# EAGLE design SDCardPlayer8BitMono (EAGLE 7.2.0)
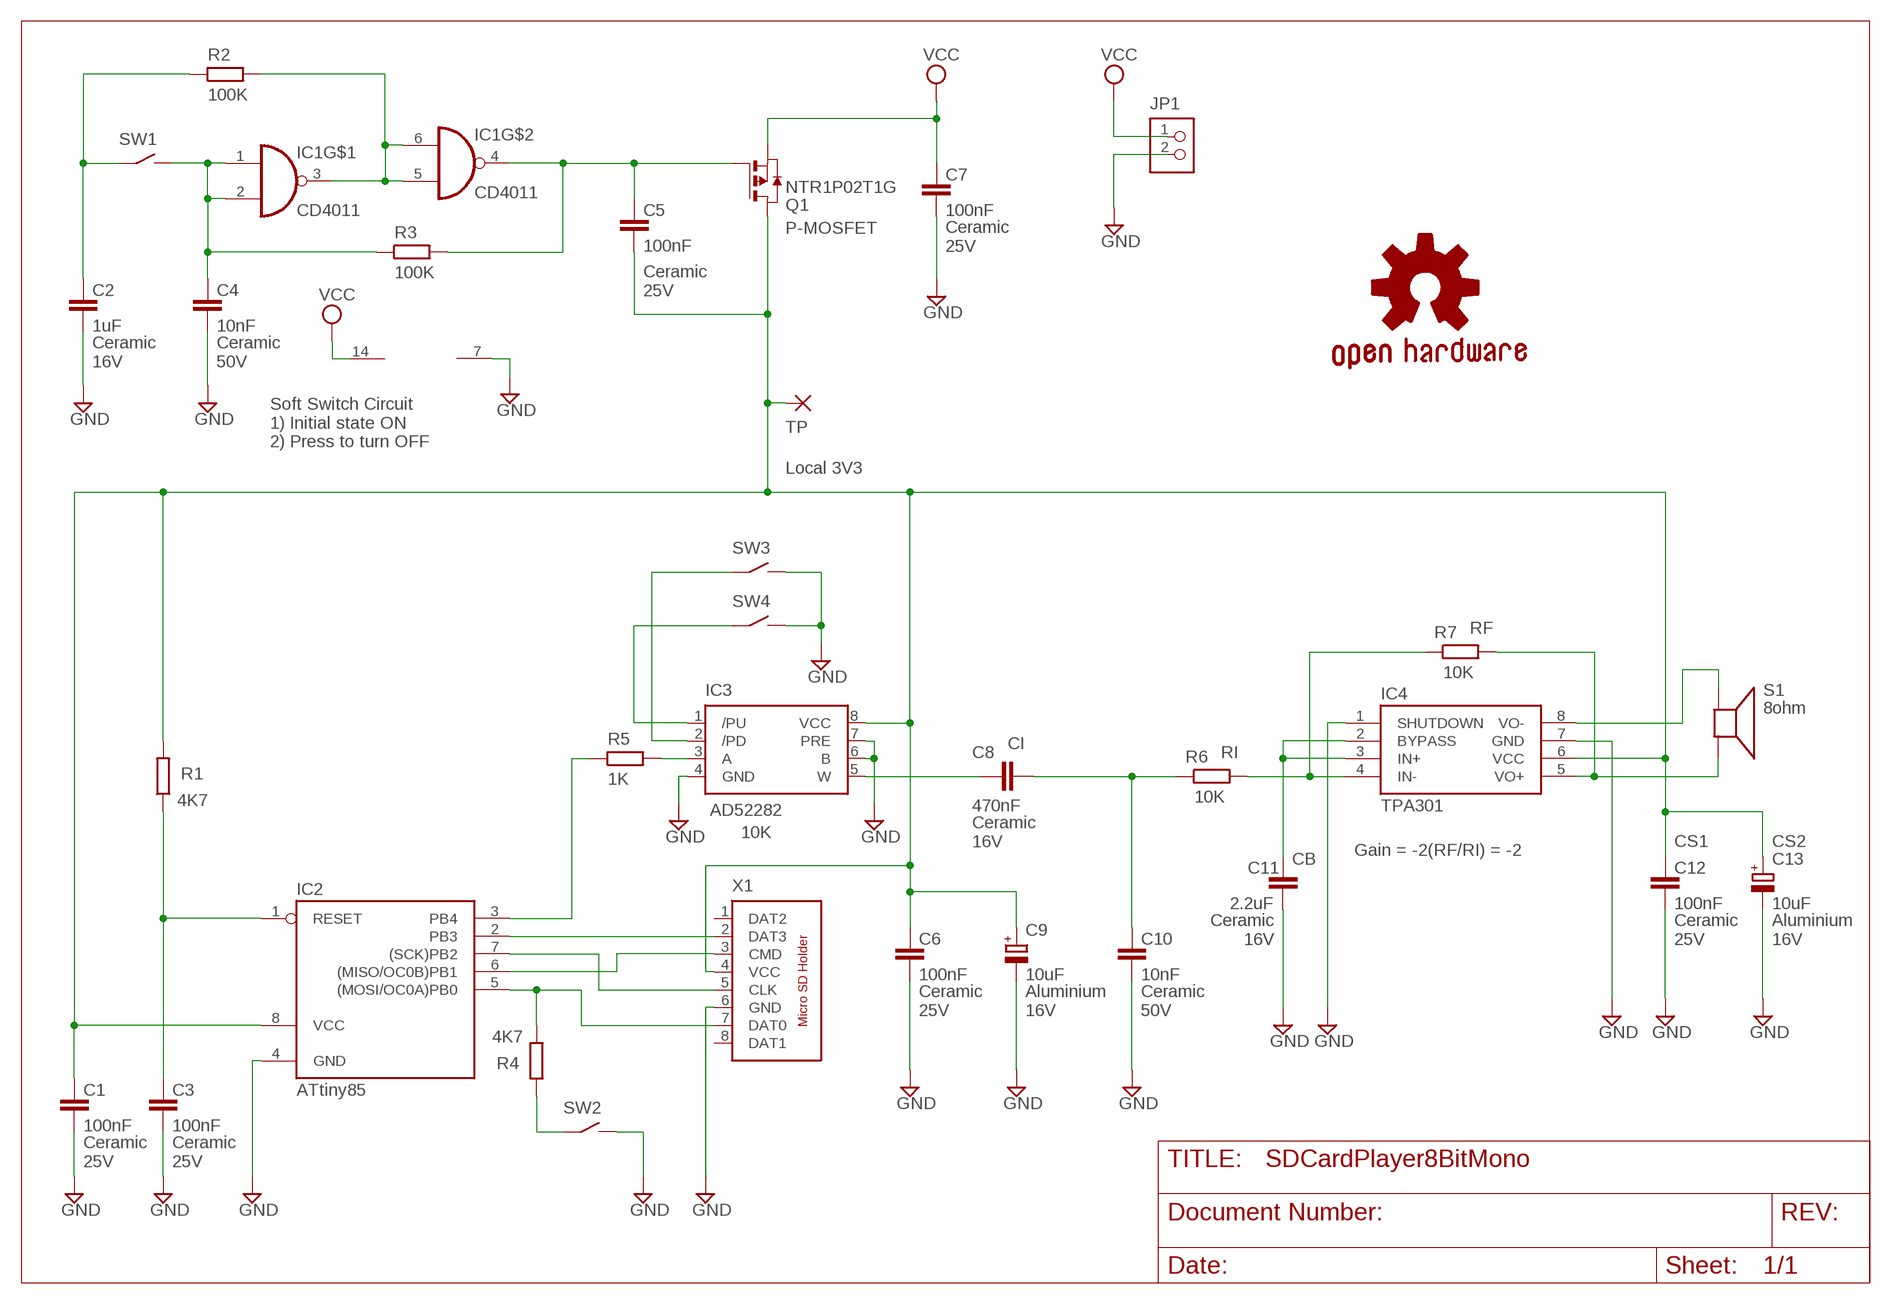
[diagram p0: schematic, sheet 1]

## Parts
C1  100nF  CAPACITOR  [P-0805]
C2  1uF  CAPACITOR  [P-0805]
C3  100nF  CAPACITOR  [P-0805]
C4  10nF  CAPACITOR  [P-0805]
C5  100nF  CAPACITOR  [P-0805]
C6  100nF  CAPACITOR  [P-0805]
C7  100nF  CAPACITOR  [P-0805]
C8  470nF  CAPACITOR  [P-0805]
C9  10uF  CAPACITOR-POL3  [P-CAPNICHICON-3MM]
C10  10nF  CAPACITOR  [P-0805]
C11  2.2uF  CAPACITOR  [P-0805]
C12  100nF  CAPACITOR  [P-0805]
C13  10uF  CAPACITOR-POL3  [P-CAPNICHICON-3MM]
GOLD_ORB_SM1  OSHWLOGO_GOLD_ORB_SM  [OSHW2]
IC1  CD4011  [P-SOIC14]
IC2  ATtiny85  ATTINY252  [P-DIL8]
IC3  AD52282  [P-SOT23-8E]
IC4  TPA301  [P-SO8]
JP1  JST-XH-1X021  [P-JST-XH-1X02]
Q1  NTR1P02T1G  P-MOSFET2  [P-SOT23-3E]
R1  4K7  RESISTOR""  [P-0805]
R2  100K  RESISTOR""  [P-0805]
R3  100K  RESISTOR""  [P-0805]
R4  4K7  RESISTOR""  [P-0805]
R5  1K  RESISTOR""  [P-0805]
R6  10K  RESISTOR""  [P-0805]
R7  10K  RESISTOR""  [P-0805]
S1  8ohm  SPEAKER2  [P-JST-XH-1X02]
SW1  SWITCH-2PIN4  [P-JST-XH-1X02]
SW2  SWITCH-2PIN4  [P-JST-XH-1X02]
SW3  SWITCH-2PIN4  [P-JST-XH-1X02]
SW4  SWITCH-2PIN4  [P-JST-XH-1X02]
TP  PAD  [P-PAD127X127]
X1  MICRO-SD-CARD-HOLDER  [P-MICRO-SD-CARD-HOLDER]

## Nets
GND: C1.2 C2.2 C3.2 C4.2 C6.2 C7.2 C9.2(-) C10.2 C11.2 C12.2 C13.2(-) IC1.7(GND) IC2.4(GND) IC3.4(GND) IC3.6(B) IC3.7(PRE) IC4.1(SHUTDOWN) IC4.7(GND) JP1.2 SW2.2 SW3.2 SW4.2 X1.6(GND)
N$1: C3.1 IC2.1(RESET) R1.1
N$2: R4.2 SW2.1
N$3: IC2.5((MOSI/OC0A)PB0) R4.1 X1.7(DAT0)
N$4: IC2.2(PB3) X1.2(DAT3)
N$5: IC2.3(PB4) R5.1
N$7: IC1.3(O) IC1.5(I1) IC1.6(I0) R2.2
N$8: C4.1 IC1.1(I0) IC1.2(I1) R3.1 SW1.2
N$9: C5.1 IC1.4(O) Q1.1(G) R3.2
N$10: C8.2 C10.1 R6.1
N$11: IC4.4(IN-) R6.2 R7.1
N$12: C2.1 R2.1 SW1.1
N$13: C11.1 IC4.2(BYPASS) IC4.3(IN+)
N$14: IC4.5(VO+) R7.2 S1.2
N$15: IC4.8(VO-) S1.1
N$16: C8.1 IC3.5(W)
N$17: IC3.2(/PD) SW3.1
N$18: IC3.1(/PU) SW4.1
N$19: IC3.3(A) R5.2
N$20: IC2.6((MISO/OC0B)PB1) X1.3(CMD)
N$21: C1.1 C5.2 C6.1 C9.1(+) C12.1 C13.1(+) IC2.8(VCC) IC3.8(VCC) IC4.6(VCC) Q1.3(D) R1.2 TP.P$1(P) X1.4(VCC)
N$23: IC2.7((SCK)PB2) X1.5(CLK)
VCC: C7.1 IC1.14(VCC) JP1.1 Q1.2(S)
Unconnected: IC1.8(I0) IC1.9(I1) IC1.10(O) IC1.11(O) IC1.12(I1) IC1.13(I0) X1.1(DAT2) X1.8(DAT1)

## Notes on the sheet
- P-MOSFET
- Ceramic
  25V
- Ceramic
  25V
- Ceramic
  16V
- Ceramic
  50V
- Soft Switch Circuit
  1) Initial state ON
  2) Press to turn OFF
- Local 3V3
- RF
- CI
- RI
- 10K
- Ceramic
  16V
- CS1 | CS2
- Gain = -2(RF/RI) = -2
- CB
- Ceramic
  16V
- Ceramic
  25V
- Aluminium
  16V
- Ceramic
  25V
- Aluminium
  16V
- Ceramic
  50V
- Ceramic
  25V
- Ceramic
  25V

## Library data of the parts
C1-C8 C10-C12 = dn-electronics:CAPACITOR: Capacitors
C9 C13 = dn-electronics:CAPACITOR-POL: Capacitors with Polarity
GOLD_ORB_SM1 = bfl:OSHWLOGO: These are Open-Source Hardware logos.
IC1 = dn-electronics:CD4011: CD4011 Quad Nand
IC2 = dn-electronics:ATTINY25: ATtiny25/45/85
IC3 = dn-electronics:AD5228: AD5228 Digital UP/DOWN Potentiometer
IC4 = dn-electronics:TPA301: TPA301 Mono Audio Amplifier
JP1 = dn-electronics:JST-XH-1X02: JST XH 1x02
Q1 = dn-electronics:P-MOSFET: P MOSFETs
R1-R7 = dn-electronics:RESISTOR: Resistors
S1 = dn-electronics:SPEAKER: Speaker
SW1-SW4 = dn-electronics:SWITCH-2PIN: Switches 2 Pin SMT Tactile DTSM31NV: RS - 3786325
TP = dn-electronics:PAD: PADs
X1 = dn-electronics:MICRO-SD-CARD-HOLDER: Micro SD Card Holder

## Board
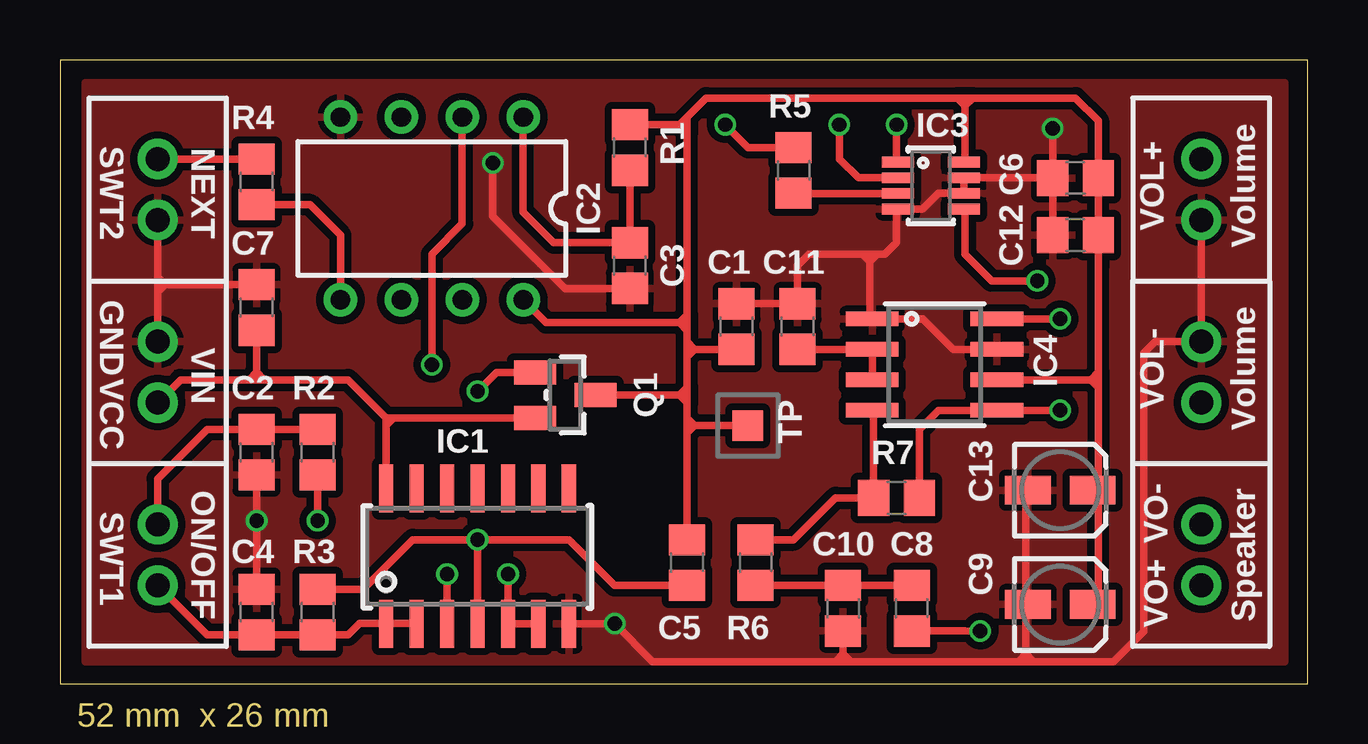
[diagram p1: board, top side]
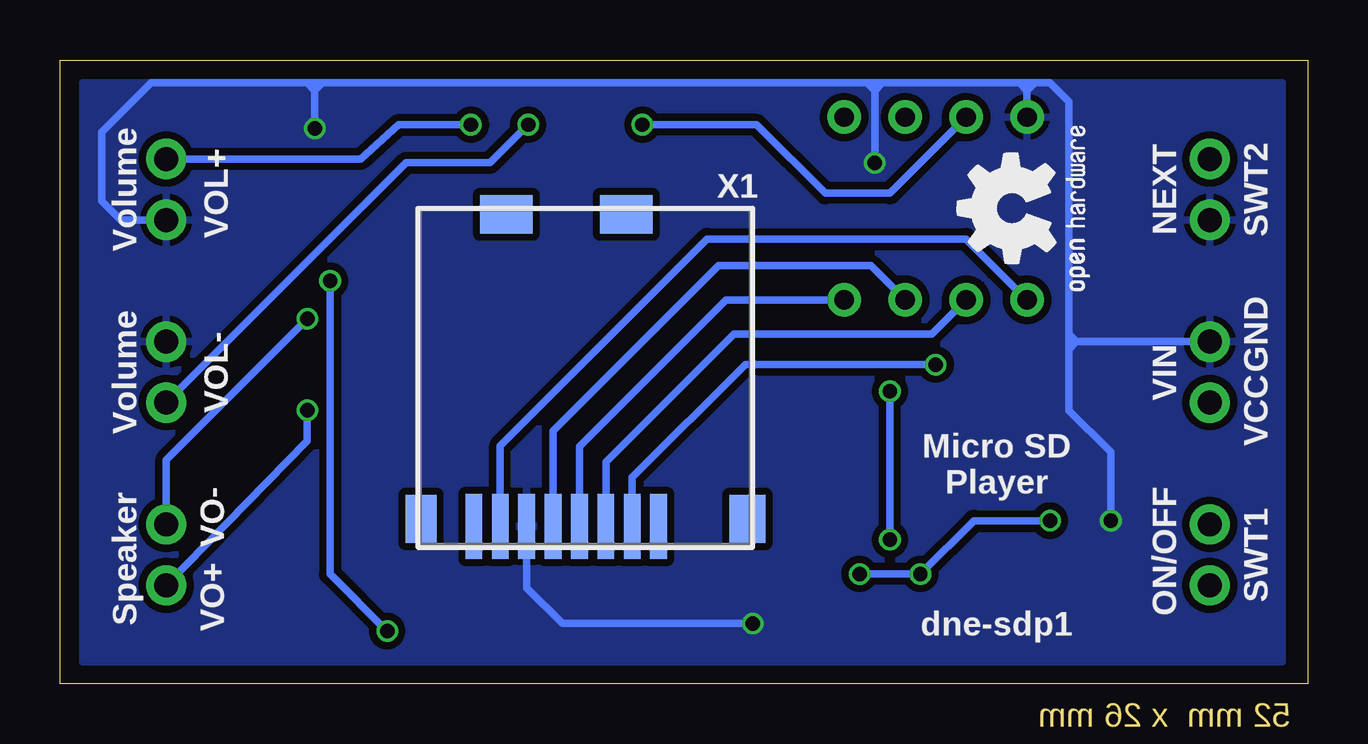
[diagram p2: board, bottom side, seen from below]

Size 52 x 26 mm. Coordinates in mm from the lower left corner, seen from the top.
Outline: 0,0 52,0 52,26 0,26 0,0
Copper layers (1*16): Top 0.018mm / dielectric 1.55mm / Bottom 0.018mm
Design rules "eC_2Layer_PClass6_BaseCopperO18_DNE": minimum track width 0.15mm, minimum drill 0.35mm, track to track 0.15mm, track to pad 0.15mm, pad to pad 0.15mm, via to via 0.15mm, smd to smd 0mil, copper to edge 0.25mm, drill to drill 0.35mm, minimum pad ring 0.175mm, minimum via ring 0.125mm, stop-mask expansion 0mil, vias tented up to drill 0.45mm, thermal gap 0.25mm

### Footprints (pad centres in the part's own frame; a part is rotated, then mirrored left to right if it is on the bottom)
P-0805 = smd 1.3 x 1.5: 1 -0.95,0; 2 0.95,0
P-CAPNICHICON-3MM = smd 1.2 x 1.9: 1 0,1.349; 2 0,-1.349
P-SOIC14 = smd 0.6 x 2: 1 -3.81,-2.708; 2 -2.54,-2.708; 3 -1.27,-2.708; 4 0,-2.708; 5 1.27,-2.708; 6 2.54,-2.708; 7 3.81,-2.708; 8 3.81,2.928; 9 2.54,2.928; 10 1.27,2.928; 11 0,2.928; 12 -1.27,2.928; 13 -2.54,2.928; 14 -3.81,2.928
P-DIL8 = drill 0.8 pad 1.4: 1 -3.81,-3.81; 2 -1.27,-3.81; 3 1.27,-3.81; 4 3.81,-3.81; 5 3.81,3.81; 6 1.27,3.81; 7 -1.27,3.81; 8 -3.81,3.81
P-SOT23-8E = smd 0.45 x 1.35: 1 -0.975,-1.369; 2 -0.325,-1.369; 3 0.325,-1.369; 4 0.975,-1.369; 5 0.975,1.381; 6 0.325,1.381; 7 -0.325,1.381; 8 -0.975,1.381
P-SO8 = smd 0.6 x 2.2: 1 -1.905,-2.6; 2 -0.635,-2.6; 3 0.635,-2.6; 4 1.905,-2.6; 5 1.905,2.6; 6 0.635,2.6; 7 -0.635,2.6; 8 -1.905,2.6
P-JST-XH-1X02 = drill 1 pad 1.676: 1 -1.27,0; 2 1.27,0
P-SOT23-3E = smd 1 x 1.75: 1 -0.95,-1.259; 2 0.95,-1.259; 3 0,1.259
P-PAD127X127 = smd 1.27 x 1.27: P$1 0,0
P-MICRO-SD-CARD-HOLDER = smd 0.7 x 2.7: 1 3.85,-6.9; 2 2.75,-6.9; 3 1.65,-6.9; 4 0.55,-6.9; 5 -0.55,-6.9; 6 -1.65,-6.9; 7 -2.75,-6.9; 8 -3.85,-6.9 | smd 1.5 x 2: 9 7.55,-6.6 | smd 1.3 x 2: 10 -6.05,-6.6 | smd 2.2 x 1.6: P$1 -2.5,6.1; P$2 2.5,6.1

### Placement (x,y rotation side)
C1  28.2,14.89 90 top
C2  8.2,9.65 270 top
C3  23.75,17.43 270 top
C4  8.2,2.98 90 top
C5  26.14,5.04 90 top
C6  42.33,21.08 180 top
C7  8.2,15.68 90 top
C8  35.5,3.14 90 top
C9  41.69,3.3 270 top
C10  32.65,3.14 270 top
C11  30.74,14.89 90 top
C12  42.33,18.7 180 top
C13  41.69,8.06 270 top
E$1  [OSHW2]  8.04,16 90 bottom
IC1  17.41,5.2 0 top
IC2  15.5,19.81 180 top
IC3  36.3,20.76 270 top
IC4  36.45,13.3 270 top
JP1  4.07,12.98 90 top
Q1  21.06,12.03 270 top
R1  23.75,22.35 90 top
R2  10.74,9.65 270 top
R3  10.74,2.98 90 top
R4  8.2,20.92 90 top
R5  30.58,21.39 270 top
R6  28.99,5.04 90 top
R7  34.87,7.74 0 top
S1  47.57,5.36 270 top
SW1  4.07,5.36 270 top
SW2  4.07,20.6 270 top
SW3  47.57,12.98 90 top
SW4  47.57,20.6 270 top
TP  28.68,10.76 90 top
X1  30.9,13.46 0 bottom

### Tracks (layer width: path | path; a pad name or v marks a point on that pad's centre or on a via)
GND  (via drill 0.6)
  Top 0.305: IC3.4 35.96,19.79 36.61,20.44 37.51,20.44 IC3.6 IC3.7 C6.2 | C9.2 40.27,3.22 40.27,1.23 | SW4.2 SW3.2 45.66,14.25 45.19,13.78 45.19,2.19 43.92,0.92 40.58,0.92 | IC3.4 34.89,19.79 34.87,19.81 | C3.2 21.05,16.48 18.04,19.49 v18.04,21.71 | IC4.7 37.25,13.93 35.98,15.2 IC4.1 33.76,15.3 33.76,17.59 | 40.27,0.92 39.95,0.92 | 40.27,1.07 40.27,0.92 | 33.76,17.9 33.76,17.59 | C6.2 41.38,20.92 41.38,18.38 C12.2 | C1.2 C11.2 30.74,17.43 31.22,17.9 33.44,17.9 | C6.2 v41.38,23.14 | 33.44,17.9 33.76,17.9 | 33.76,17.9 34.07,17.9 | 34.07,17.9 34.39,17.9 34.87,18.38 34.87,19.73 IC3.4 | 40.27,0.92 40.42,0.92 | 40.42,0.92 40.58,0.92 | 39.95,0.92 40.27,1.23 | 40.27,1.23 40.27,1.07 | 40.27,1.07 40.42,0.92 | 40.27,1.23 40.58,0.92 | 33.44,17.9 33.76,17.59 | 33.76,17.59 34.07,17.9 | IC1.7 v23.13,2.49 v23.12,2.5 24.71,0.92 32.33,0.92 | 32.33,0.92 32.65,0.92 | 32.65,0.92 32.96,0.92 | 32.96,0.92 39.95,0.92 | C10.2 32.65,1.23 | 32.65,1.23 32.65,0.92 | 32.33,0.92 32.65,1.23 | 32.96,0.92 32.65,1.23 | 40.27,3.3 40.27,8.06 C13.2 | C4.2 v8.2,6.79 C2.2 | C7.2 4.07,16.63 | 4.07,16.63 4.07,16.32 | 4.07,16.32 JP1.2 | SW2.2 4.07,16.95 | 4.07,16.95 4.07,16.63 | 4.07,16.32 4.39,16.63 4.07,16.95
  Top 0.406: C9.2 40.27,3.3
  Bottom 0.305: 9.94,14.25 9.63,14.25 | 9.63,14.25 JP1.2 | v18.04,21.71 18.04,24.73 | 18.04,24.73 18.04,25.05 | 17.72,25.05 18.04,24.73 | 18.04,24.73 18.36,25.05 | 18.36,25.05 18.04,25.05 | 18.04,25.05 17.72,25.05 | 18.36,25.05 41.06,25.05 | 41.06,25.05 41.38,25.05 | 41.38,25.05 41.69,25.05 | 41.69,25.05 48.2,25.05 50.27,22.98 50.27,20.12 49.47,19.33 SW4.2 | v41.38,23.14 41.38,24.73 | 41.38,24.73 41.38,25.05 | 41.06,25.05 41.38,24.73 | 41.38,24.73 41.69,25.05 | X1.6 32.55,4 31.06,2.5 v23.12,2.5 | 9.94,13.93 9.94,14.25 | 9.94,14.25 9.94,14.57 | 9.94,14.57 9.94,24.25 10.74,25.05 11.37,25.05 | 11.37,25.05 11.69,25.05 | 11.69,25.05 12.01,25.05 | 12.01,25.05 17.72,25.05 | IC2.4 11.69,24.73 | 11.69,24.73 11.69,25.05 | 9.94,13.93 9.63,14.25 | 9.63,14.25 9.94,14.57 | 12.01,25.05 11.69,24.73 | 11.69,24.73 11.37,25.05 | 9.94,13.93 9.94,11.39 8.2,9.65 v8.2,6.79
  pour Bottom (isolate 0.305): 51.06,25.05 1.05,25.05 1.05,0.92 51.06,0.92
  pour Top (isolate 0.305): 51.06,25.05 1.05,25.05 1.05,0.92 51.06,0.92
N$1
  Top 0.305: R1.1 C3.1 20.58,18.38 19.31,19.65 IC2.1
N$2
  Top 0.305: SW2.1 R4.2
N$3
  Top 0.305: IC2.5 11.69,18.7 10.42,19.97 R4.1
  Bottom 0.305: IC2.5 14.23,18.54 25.02,18.54 33.65,9.91 X1.7
N$4  (via drill 0.6)
  Top 0.305: v15.5,13.3 15.5,17.9 16.77,19.17 IC2.2
  Bottom 0.305: X1.2 28.15,8.59 23.44,13.3 v15.5,13.3
N$5  (via drill 0.6)
  Top 0.305: R5.1 28.68,22.34 v27.72,23.3
  Bottom 0.305: IC2.3 17.41,20.44 20.1,20.44 22.96,23.3 v27.72,23.3
N$7  (via drill 0.6)
  Top 0.305: IC1.3 v16.14,4.57 | v18.68,4.57 IC1.5 IC1.6 | v10.74,6.79 R2.2
  Bottom 0.305: v18.68,4.57 v16.14,4.57 13.91,6.79 v10.74,6.79
N$8
  Top 0.305: 14.71,2.5 13.6,2.5 IC1.1 13.59,2.5 12.48,2.5 12.01,2.03 R3.1 C4.1 6.13,2.03 SW1.2
  Top 0.406: IC1.2 14.72,2.49 14.71,2.5
N$9  (via drill 0.6)
  Top 0.305: IC1.4 v17.41,6 | v17.41,6 21.21,6 23.12,4.09 C5.1 | v17.4,5.99 v17.41,6 | R3.2 11.06,3.93 12.64,3.93 14.71,6 v17.41,6 | Q1.1 18.2,12.98 v17.41,12.19
  Bottom 0.305: v17.41,6 v17.41,12.19
N$10
  Top 0.305: R6.1 32.8,4.09 | 32.8,4.09 C10.1 | 32.8,4.09 35.66,4.09 C8.2
N$11
  Top 0.305: IC4.4 33.91,11.33 33.91,8.38 R7.1 32.33,7.74 30.58,5.99 R6.2
N$12
  Top 0.305: R2.1 C2.1 6.13,10.6 4.07,8.54 SW1.1
N$13
  Top 0.305: IC4.3 IC4.2 C11.1
N$14  (via drill 0.6)
  Top 0.305: R7.2 35.82,10.6 36.61,11.39 IC4.5 v41.69,11.39
  Bottom 0.305: S1.2 41.69,10.12 v41.69,11.39
N$15  (via drill 0.6)
  Top 0.305: IC4.8 v41.69,15.2
  Bottom 0.305: S1.1 47.57,9.33 v41.69,15.2
N$16  (via drill 0.6)
  Top 0.305: 37.57,19.73 IC3.5 37.73,19.83 37.73,17.9 38.84,16.79 v40.74,16.79 | C8.1 37.72,2.19 v38.36,2.19
  Bottom 0.305: v40.74,16.79 40.74,4.57 v38.36,2.19
N$17  (via drill 0.6)
  Top 0.305: IC3.2 33.27,21.09 32.49,21.87 v32.49,23.3
  Bottom 0.305: SW3.1 37.57,21.71 34.07,21.71 v32.49,23.3
N$18  (via drill 0.6)
  Top 0.305: v34.87,23.3 34.87,21.8 IC3.1
  Bottom 0.305: SW4.1 39.47,21.87 37.88,23.3 v34.87,23.3
N$19
  Top 0.305: IC3.3 31.22,20.43 R5.2
N$20
  Bottom 0.305: IC2.6 15.66,14.57 23.91,14.57 29.25,9.23 X1.3
N$21
  Top 0.305: IC4.6 42.96,12.66 | 42.96,12.66 43.28,12.66 | 43.28,12.66 43.28,12.98 | 43.28,12.66 43.28,12.35 | 43.28,12.35 43.28,8.14 C13.1 43.28,7.82 43.28,3.3 C9.1 | 43.28,12.35 42.96,12.66 | 42.96,12.66 43.28,12.98 | C5.2 26.14,10.44 | 26.14,10.44 26.14,10.76 | 26.14,10.76 26.14,11.08 | 26.14,11.08 26.14,11.71 | 26.14,11.71 26.14,12.02 Q1.3 26.14,12.04 26.14,12.35 | 26.14,12.35 26.14,13.62 | 26.14,13.62 26.14,14.09 | 26.14,14.09 26.14,14.25 | 26.14,14.25 26.14,14.73 | 26.14,14.73 26.14,15.04 | 26.14,15.04 26.14,15.36 | 26.14,11.71 25.82,12.03 26.14,12.35 | 25.82,15.04 26.14,15.04 | 26.14,14.73 25.82,15.04 | 25.82,15.04 26.14,15.36 | 26.14,15.36 26.14,22.98 | 26.14,22.98 26.14,23.14 | 26.14,23.14 26.14,23.62 | 25.82,23.3 26.14,23.14 | TP.P$1 26.45,10.76 | 26.45,10.76 26.14,10.76 | 26.14,10.44 26.45,10.76 | 26.45,10.76 26.14,11.08 | 26.14,22.98 25.82,23.3 | 25.82,23.3 26.14,23.62 | 25.82,23.3 | 37.41,24.41 37.73,24.41 | 37.73,24.41 38.04,24.41 | 38.04,24.41 42.33,24.41 43.28,23.46 C6.1 C12.1 43.28,17.42 43.28,12.98 | IC3.8 37.7,21.73 37.73,21.71 37.73,24.09 | 37.73,24.09 37.73,24.41 | 37.41,24.41 37.73,24.09 | 37.73,24.09 38.04,24.41 | 37.41,24.41 26.93,24.41 26.14,23.62 | C1.1 26.13,13.94 26.14,14.09 | 25.82,15.04 20.26,15.04 IC2.8 | 26.14,13.62 26.45,13.93 26.14,14.25 | 25.82,23.3 R1.2
  Bottom 0.305: IC2.8 24.23,16 30.35,9.88 X1.4
N$23
  Bottom 0.305: IC2.7 18.2,17.43 24.55,17.43 31.45,10.53 X1.5
VCC
  Top 0.305: Q1.2 19.47,11.08 13.91,11.08 | IC1.14 13.6,10.76 | 13.6,10.76 13.6,11.08 | 13.91,11.08 13.6,11.08 | JP1.1 5.02,12.66 7.88,12.66 | 7.88,12.66 8.2,12.66 | 8.2,12.66 8.52,12.66 | 8.52,12.66 12.01,12.66 13.6,11.08 | C7.1 8.2,12.98 | 8.2,12.98 8.2,12.66 | 8.52,12.66 8.2,12.98 | 8.2,12.98 7.88,12.66 | 13.6,10.76 13.91,11.08
  Top 0.406: IC1.14 13.6,8.06

### Text on the board
Dimension: 52 mm x 26 mm
tNames: R4 | R5 | R1 | IC3 | C6 | VOL+ | Volume | SWT2 | NEXT | IC2 | C12 | C7 | C1 | C11 | C3 | GND | VIN | IC4 | VOL- | Volume | C2 | R2 | Q1 | VCC | TP | IC1 | R7 | C13 | VO- | C4 | R3 | C10 | C8 | SWT1 | ON/OFF | C9 | Speaker | VO+ | C5 | R6
bNames: SWT2 | NEXT | X1 | Volume | VOL+ | GND | VIN | VOL- | Volume | VCC | Micro SD / Player | VO- | ON/OFF | SWT1 | Speaker | VO+ | dne-sdp1